# Altium project UKU201.PrjPCB
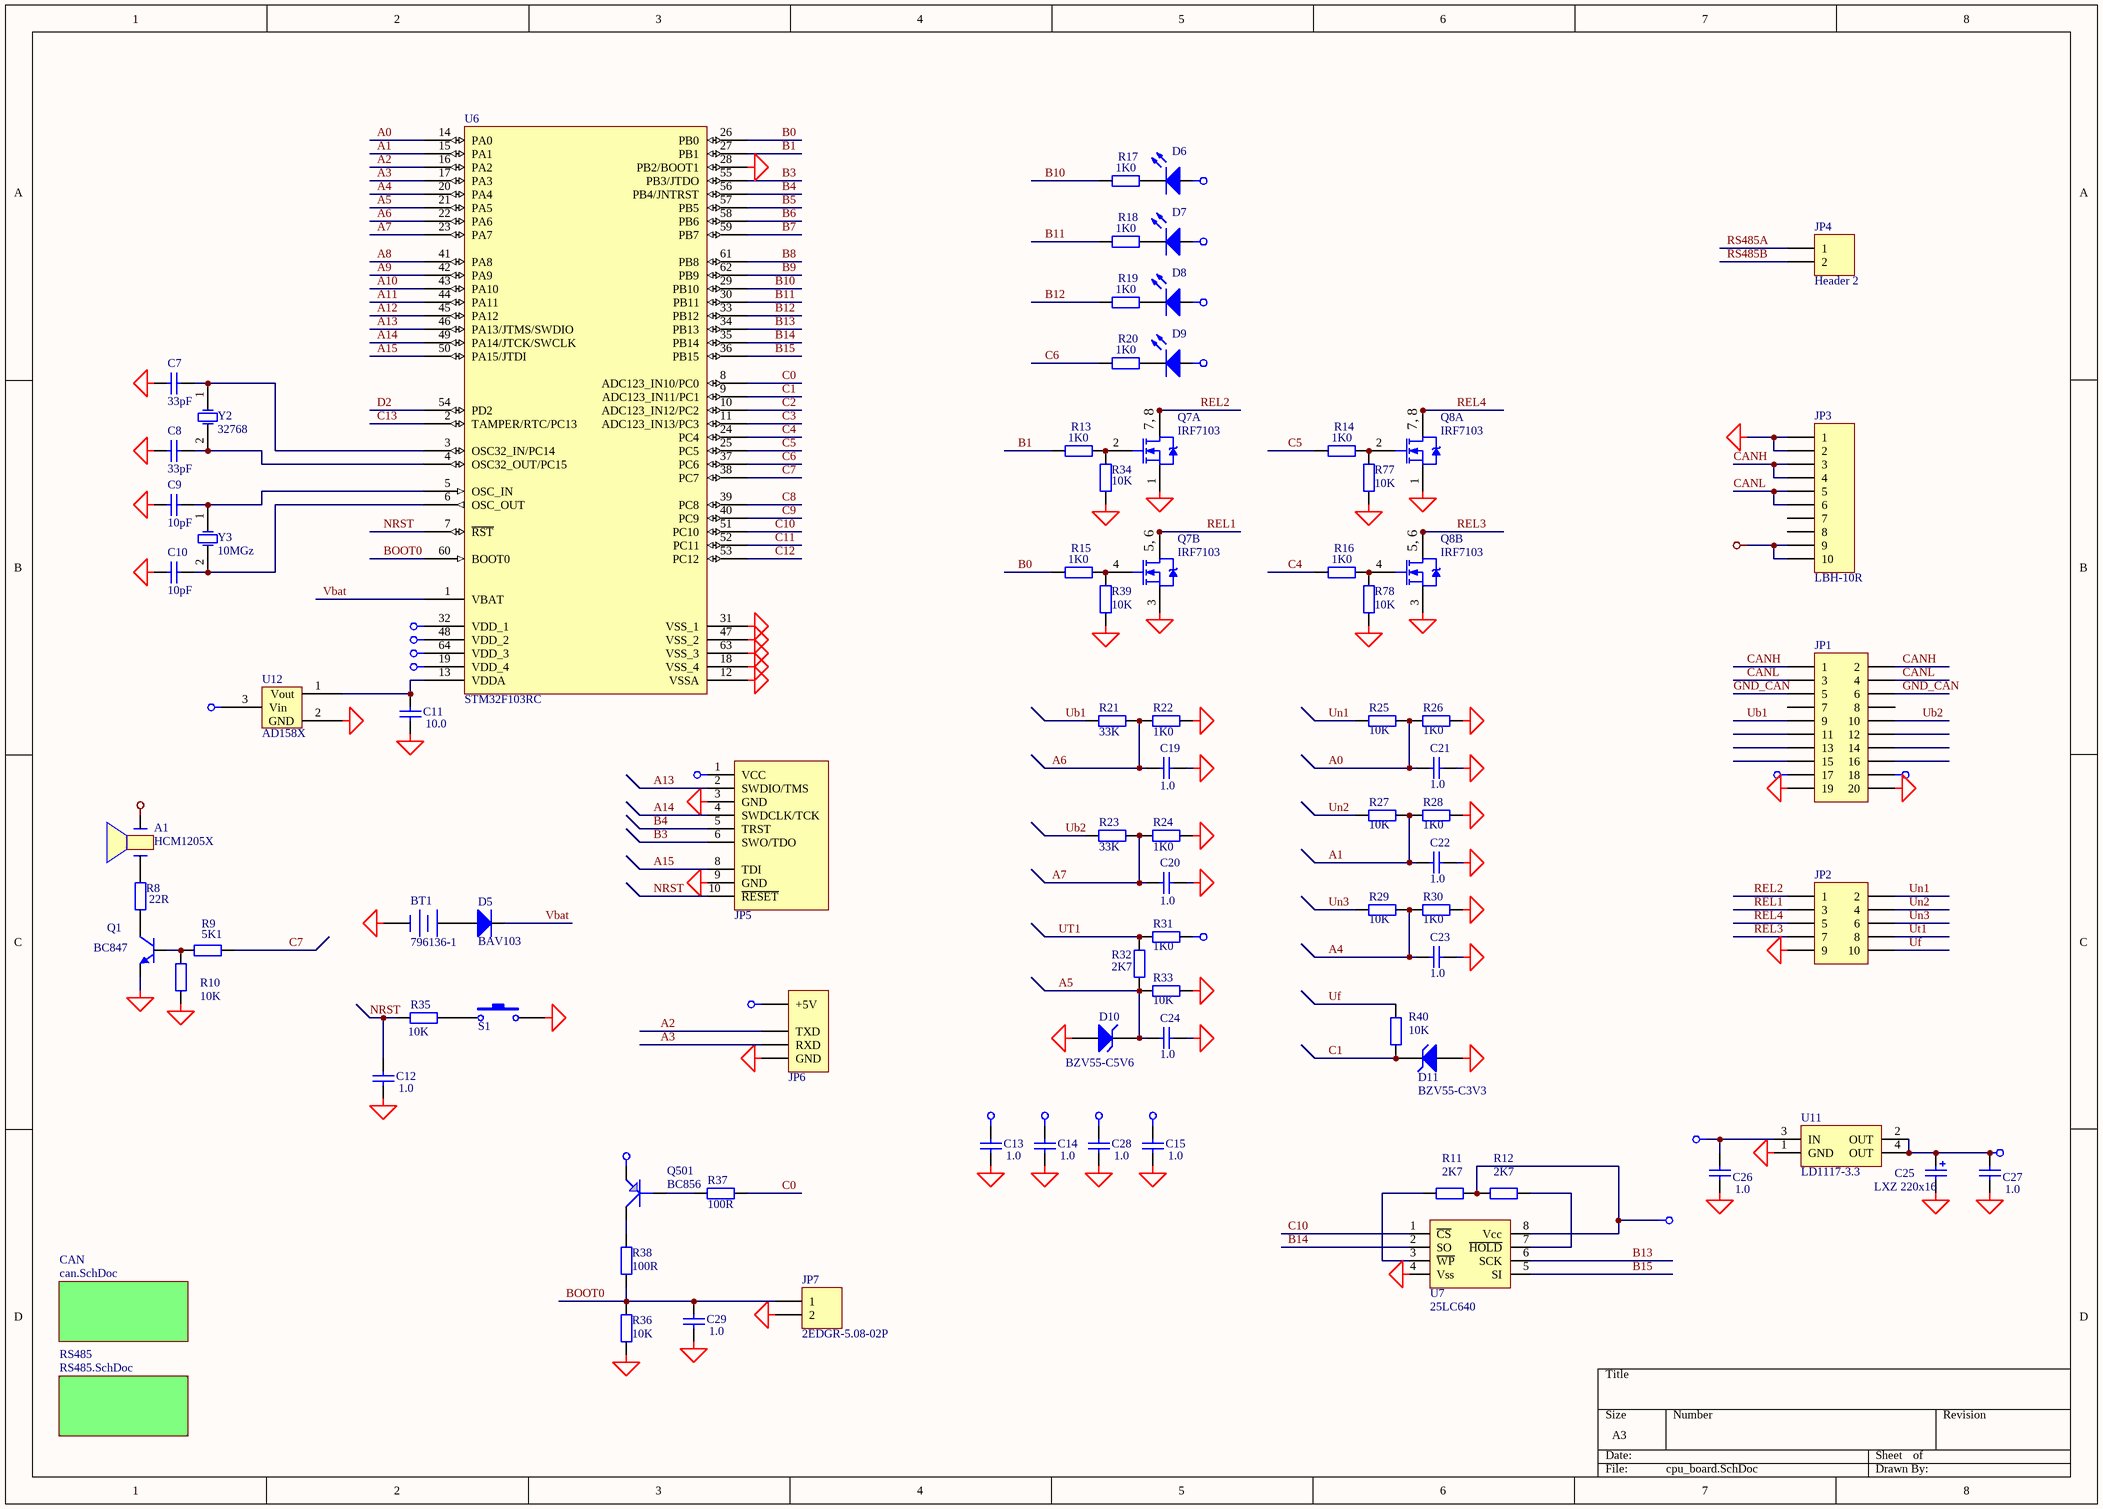
[diagram p0: cpu_board.SchDoc]
2 sheets, 102 parts. Net scope: global (net labels, ports and power ports of the same name join across sheets).
Board file: uku201.PcbDoc
Sheets:
  cpu_board.SchDoc
    CAN = can.SchDoc

## Sheet cpu_board.SchDoc
size A3

### Parts
A1  HCM1205X  [zumm]
BT1  796136-1  [BAT_HOLD_SMD]
C7  33pF  [_1206]
C8  33pF  [_1206]
C9  10pF  [_1206]
C10  10pF  [_1206]
C11  10.0  [_1206]
C12  1.0  [_1206]
C13  1.0  [_1206]
C14  1.0  [_1206]
C15  1.0  [_1206]
C19  1.0  [_1206]
C20  1.0  [_1206]
C21  1.0  [_1206]
C22  1.0  [_1206]
C23  1.0  [_1206]
C24  1.0  [_1206]
C25  LXZ 220x16  [el3]
C26  1.0  [_1206]
C27  1.0  [_1206]
C28  1.0  [_1206]
C29  1.0  [_1206]
D5  BAV103  [_1206d]
D6  LED0  [el3]  (value not drawn)
D7  LED0  [el3]  (value not drawn)
D8  LED0  [el3]  (value not drawn)
D9  LED0  [el3]  (value not drawn)
D10  BZV55-C5V6  [_1206d]
D11  BZV55-C3V3  [_1206d]
JP1  PBD-10  [HDR2X10]  (value not drawn)
JP2  PBD-10  [HDR2X5]  (value not drawn)
JP3  LBH-10R  [SCM-10MR]
JP4  Header 2  [2EDGR-5.0-2P]
JP5  CORTEX_DEBUG_CONNECTOR_PAL  [CORTEX_DEBUG_CONNECTOR]  (value not drawn)
JP6  UART_PORT  [HDR1X5_uart]  (value not drawn)
JP7  2EDGR-5.08-02P  [HDR1X2]
Q1  BC847  [SO-G3]
Q7  IRF7103  [SO-G8/Y2.2]  (parts A,B of 2)
Q8  IRF7103  [SO-G8/Y2.2]  (parts A,B of 2)
Q501  BC856  [SO-G3]
R8  22R  [_1206]
R9  5K1  [_1206]
R10  10K  [_1206]
R11  2K7  [_1206]
R12  2K7  [_1206]
R13  1K0  [_1206]
R14  1K0  [_1206]
R15  1K0  [_1206]
R16  1K0  [_1206]
R17  1K0  [_1206]
R18  1K0  [_1206]
R19  1K0  [_1206]
R20  1K0  [_1206]
R21  33K  [_1206]
R22  1K0  [_1206]
R23  33K  [_1206]
R24  1K0  [_1206]
R25  10K  [_1206]
R26  1K0  [_1206]
R27  10K  [_1206]
R28  1K0  [_1206]
R29  10K  [_1206]
R30  1K0  [_1206]
R31  1K0  [_1206]
R32  2K7  [_1206]
R33  10K  [_1206]
R34  10K  [_1206]
R35  10K  [_1206]
R36  10K  [_1206]
R37  100R  [_1206]
R38  100R  [_1206]
R39  10K  [_1206]
R40  10K  [_1206]
R77  10K  [_1206]
R78  10K  [_1206]
S1  SWT-3  [SWT-6R]  (value not drawn)
U6  STM32F103RC  [F-QFP10X10-G64/N]
U7  25LC640  [SO-G8/D5]
U11  LD1117-3.3  [DSO-G3]
U12  AD158X  [so-g3]
Y2  32768  [QWARZ2]
Y3  10MGz  [QWARZ1]

### Sub-sheets
CAN = can.SchDoc: no entries
RS485 = RS485.SchDoc (file not in this document): no entries

### Nets
+3v3: C13.2 C14.2 C25.1 C27.2 C28.2 D6.1(A) D7.1(A) D8.1(A) D9.1(A) JP5.1(VCC) Q501.2(E) U6.19(VDD_4) U6.32(VDD_1) U6.48(VDD_2) U6.64(VDD_3) U11.2(OUT) U11.4(OUT)
+5v: A1.1 C15.2 C26.2 JP1.17 JP1.18 JP3.9 JP3.10 JP6.1(+5V) R11.2 R12.1 R31.2 U7.8(Vcc) U11.3(IN) U12.3(Vin)
GND: BT1.2(-) C7.1 C8.1 C9.1 C10.1 C11.1 C12.1 C13.1 C14.1 C15.1 C19.2 C20.2 C21.2 C22.2 C23.2 C24.2 C25.2 C26.1 C27.1 C28.1 C29.1 D10.1(A) D11.1(A) JP1.19 JP1.20 JP2.9 JP3.1 JP3.2 JP5.3(GND) JP5.9(GND) JP7.2 Q1.2(E) Q7.1(S) Q7.3(S) Q8.1(S) Q8.3(S) R10.2 R22.2 R24.2 R26.2 R28.2 R30.2 R33.1 R34.1 R36.1 R39.1 R77.1 R78.1 S1.1 U6.12(VSSA) U6.18(VSS_4) U6.28(PB2/BOOT1) U6.31(VSS_1) U6.47(VSS_2) U6.63(VSS_3) U7.4(Vss) U11.1(GND) U12.2(GND)
GND_CAN: JP1.5 JP1.6
SGND: JP6.5(GND)
A0: C21.1 R25.1 R26.1 U6.14(PA0)
A1: C22.1 R27.1 R28.1 U6.15(PA1)
A2: JP6.3(TXD) U6.16(PA2)
A3: JP6.4(RXD) U6.17(PA3)
A4: C23.1 R29.1 R30.1 U6.20(PA4)
A5: C24.1 D10.2(K) R32.2 R33.2 U6.21(PA5)
A6: C19.1 R21.1 R22.1 U6.22(PA6)
A7: C20.1 R23.1 R24.1 U6.23(PA7)
A8: U6.41(PA8)
A9: U6.42(PA9)
A10: U6.43(PA10)
A11: U6.44(PA11)
A12: U6.45(PA12)
A13: JP5.2(SWDIO/TMS) U6.46(PA13/JTMS/SWDIO)
A14: JP5.4(SWDCLK/TCK) U6.49(PA14/JTCK/SWCLK)
A15: JP5.8(TDI) U6.50(PA15/JTDI)
B0: R15.1 U6.26(PB0)
B1: R13.1 U6.27(PB1)
B3: JP5.6(SWO/TDO) U6.55(PB3/JTDO)
B4: JP5.5(TRST) U6.56(PB4/JNTRST)
B5: U6.57(PB5)
B6: U6.58(PB6)
B7: U6.59(PB7)
B8: U6.61(PB8)
B9: U6.62(PB9)
B10: R17.1 U6.29(PB10)
B11: R18.1 U6.30(PB11)
B12: R19.1 U6.33(PB12)
B13: U6.34(PB13) U7.6(SCK)
B14: U6.35(PB14) U7.2(SO)
B15: U6.36(PB15) U7.5(SI)
BOOT0: C29.2 JP7.1 R36.2 R38.1 U6.60(BOOT0)
C0: R37.1 U6.8(ADC123_IN10/PC0)
C1: D11.2(K) R40.2 U6.9(ADC123_IN11/PC1)
C2: U6.10(ADC123_IN12/PC2)
C3: U6.11(ADC123_IN13/PC3)
C4: R16.1 U6.24(PC4)
C5: R14.1 U6.25(PC5)
C6: R20.1 U6.37(PC6)
C7: R9.2 U6.38(PC7)
C8: U6.39(PC8)
C9: U6.40(PC9)
C10: U6.51(PC10) U7.1(~{CS})
C11: U6.52(PC11)
C12: U6.53(PC12)
C13: U6.2(TAMPER/RTC/PC13)
CANH: JP1.1 JP1.2 JP3.3 JP3.4
CANL: JP1.3 JP1.4 JP3.5 JP3.6
D2: U6.54(PD2)
NRST: C12.2 JP5.10(~{RESET}) R35.1 U6.7(~{RST})
REL1: JP2.3 Q7.5(D) Q7.6(D)
REL2: JP2.1 Q7.7(D) Q7.8(D)
REL3: JP2.7 Q8.5(D) Q8.6(D)
REL4: JP2.5 Q8.7(D) Q8.8(D)
RS485A: JP4.1
RS485B: JP4.2
Ub1: JP1.9 R21.2
Ub2: JP1.10 R23.2
Uf: JP2.10 R40.1
Un1: JP2.2 R25.2
Un2: JP2.4 R27.2
Un3: JP2.6 R29.2
Ut1: JP2.8 R31.1 R32.1
Vbat: D5.2(K) U6.1(VBAT)
NetA1_2: A1.2 R8.1
NetBT1_1: BT1.1(+) D5.1(A)
NetC7_2: C7.2 U6.3(OSC32_IN/PC14) Y2.1(OSC1)
NetC8_2: C8.2 U6.4(OSC32_OUT/PC15) Y2.2(OSC2)
NetC9_2: C9.2 U6.5(OSC_IN) Y3.1(OSC1)
NetC10_2: C10.2 U6.6(OSC_OUT) Y3.2(OSC2)
NetC11_2: C11.2 U6.13(VDDA) U12.1(Vout)
NetD6_2: D6.2(K) R17.2
NetD7_2: D7.2(K) R18.2
NetD8_2: D8.2(K) R19.2
NetD9_2: D9.2(K) R20.2
NetQ1_1: Q1.1(B) R9.1 R10.1
NetQ1_3: Q1.3(C) R8.2
NetQ7_2: Q7.2(G) R13.2 R34.2
NetQ7_4: Q7.4(G) R15.2 R39.2
NetQ8_2: Q8.2(G) R14.2 R77.2
NetQ8_4: Q8.4(G) R16.2 R78.2
NetQ501_1: Q501.1(B) R37.2
NetQ501_3: Q501.3(C) R38.2
NetR11_1: R11.1 U7.3(~{WP})
NetR12_2: R12.2 U7.7(~{HOLD})
NetR35_2: R35.2 S1.2

Not connected (* = marked no-connect by the designer): JP1 7 8 11 12 13 14 15 16; JP3 7 8

### Notes on the sheet
- (in symbol IRF7301, part A) 7, 8
- (in symbol IRF7301, part B) 5, 6

### Library data of the parts
A1 = PJEZ0: Beeper; Value: EFM260
BT1 = Battery: Multicell Battery; Manufacturer: Generic Components; Published: 24-Mar-1999; Revision: July-2002: Re-released for DXP Platform.; Publisher: Altium Limited
C7 C8 = Cap Semi: Capacitor (Semiconductor SIM Model); Manufacturer: Generic Components; Class I: Passive; Value: 15pF; Published: 8-Jun-2000; Revision: July-2002: Re-released for DXP Platform.; Publisher: Altium Limited; Class II: Capacitor
C9 C10 = Cap Semi: Capacitor; Manufacturer: Generic Components; Class I: Passive; Value: 15pF; Published: 8-Jun-2000; Revision: July-2002: Re-released for DXP Platform.; Publisher: Altium Limited; Class II: Capacitor
C11-C15 C26-C29 = Cap Semi: Capacitor; Manufacturer: Generic Components; Class I: Passive; Value: 0,1; Published: 8-Jun-2000; Revision: July-2002: Re-released for DXP Platform.; Publisher: Altium Limited; Class II: Capacitor
C19-C24 = Cap Semi: Capacitor; Manufacturer: Generic Components; Class I: Passive; Value: 1,0; Published: 8-Jun-2000; Revision: July-2002: Re-released for DXP Platform.; Publisher: Altium Limited; Class II: Capacitor
C25 = Cap Pol1: Polarized Capacitor (Radial); Manufacturer: Generic Components; Class I: Passive; Value: 22,0x50; Published: 8-Jun-2000; Revision: July-2002: Re-released for DXP Platform.; Publisher: Altium Limited; Class II: Capacitor
D5 = Diode: Default Diode; Manufacturer: Generic Components; Class I: Discrete; Class II: Diode - Switching; Published: 8-Jun-2000; Revision: July-2002: Re-released for DXP Platform.; Publisher: Altium Limited
D6-D9 = LED0: Typical INFRARED GaAs LED; Manufacturer: Generic Components; Class I: Optoelectronic; Published: 8-Jun-2000; Revision: July-2002: Re-released for DXP Platform.; Publisher: Altium Limited; Class II: LED
D10 D11 = D Zener: Zener Diode; Manufacturer: Generic Components; Class I: Discrete; Class II: Diode - Zener; Value: BZV55C5V6; Published: 8-Jun-2000; Revision: July-2002: Re-released for DXP Platform.; Publisher: Altium Limited
JP1 = Header 10X2: Header, 10-Pin, Dual row; Manufacturer: Generic Components; Class I: Connector; Revision: July-2002: Re-released for DXP Platform.; Publisher: Altium Limited
JP2 = Header 5X2: Header, 5-Pin, Dual row; Manufacturer: Generic Components; Class I: Connector; Revision: July-2002: Re-released for DXP Platform.; Publisher: Altium Limited
JP3 = Header 10: Header, 10-Pin; Manufacturer: Generic Components; Class I: Connector; Revision: July-2002: Re-released for DXP Platform.; Publisher: Altium Limited
JP4 JP7 = Header 2: Header, 2-Pin; Manufacturer: Generic Components; Class I: Connector; Revision: July-2002: Re-released for DXP Platform.; Publisher: Altium Limited
JP6 = UART_PORT: Header, 5-Pin; Manufacturer: Generic Components; Class I: Connector; Revision: July-2002: Re-released for DXP Platform.; Publisher: Altium Limited
Q1 = BC847ALT1: General Purpose Transistor NPN Silicon; Manufacturer: Motorola; Package Information: Latest Revision: 1997; Class I: Discrete; Class II: BJT - Low Power; Published: 29-Sep-2000; Revision: July-2002: Re-released for DXP Platform.; Datasheet: Latest Revision: 1997; Package Reference: 318-08; Publisher: Altium Limited
Q7 Q8 = IRF7301: FET; Manufacturer: International Rectifier; Revision 1: 29-Sep-2000: Re-orientated a 'Drain' pin on first part.; Revision 2: July-2002: Re-released for DXP Platform.; Class I: Discrete; Class II: MOSFET - Power; Published: 8-Jun-2000; Datasheet: Latest Revision: Aug-1997; Package Reference: SOIC8; Publisher: Altium Limited; Value: IRF7103
Q501 = GT109: Bipolar transistor; Right: 20; Bottom: 20; Value: BC856
R8 = Res2: Resistor; Manufacturer: Generic Components; Class I: Passive; Value: 10R; Published: 8-Jun-2000; Revision: July-2002: Re-released for DXP Platform.; Publisher: Altium Limited; Class II: Resistor
R9 = Res2: Resistor; Manufacturer: Generic Components; Class I: Passive; Value: 1K; Published: 8-Jun-2000; Revision: July-2002: Re-released for DXP Platform.; Publisher: Altium Limited; Class II: Resistor
R10 = Res2: Resistor; Manufacturer: Generic Components; Class I: Passive; Published: 8-Jun-2000; Revision: July-2002: Re-released for DXP Platform.; Publisher: Altium Limited; Class II: Resistor; Value: 10K
R11-R34 R39 R40 R77 R78 = Res2: Resistor; Manufacturer: Generic Components; Class I: Passive; Rule: Undefined; Published: 8-Jun-2000; Revision: July-2002: Re-released for DXP Platform.; Publisher: Altium Limited; Class II: Resistor
  R11 R12 R32: Value: 2K7
  R13-R20 R22 R24 R26 R28 R30 R31: Value: 1K0
  R21 R23: Value: 33K
  R25 R27 R29 R33 R34 R39 R40 R77 R78: Value: 10K
R35-R38 = RES: Resistor; Manufacturer: Generic Components; Class I: Passive; Value: 1K; Published: 8-Jun-2000; Revision: July-2002: Re-released for DXP Platform.; Publisher: Altium Limited; Class II: Resistor
S1 = SWT-6: Switch; Manufacturer: Generic Components; Published: 24-Mar-1999; Revision: July-2002: Re-released for DXP Platform.; Publisher: Altium Limited
U6 = STM32F103RC: STM32 ARM-based 32-bit MCU with 64 Kbytes Flash, 64-pin LQFP, Industrial Temperature; Published: *; DatasheetVersion: *; PackageVersion: *; PackageReference: *; Publisher: *; PackageDescription: *; ComponentLink1Description: *; ComponentLink1URL: *; ComponentLink2Description: *; ComponentLink2URL: *
U7 = 25LC640: Memory; Value: 26LC640
U11 = REG1117-3.3: 800mA and 1A Low Dropout Positive Regulator 2.85V, 3.3V, 5V, and Adjustable; Manufacturer: Burr-Brown; Package Information: Latest Revision: Rev. C; Class I: Power Management; Class II: Voltage Regulator; Published: 8-Jun-2000; Revision: July-2002: Re-released for DXP Platform.; Datasheet: Latest Revision: Sep-1997; Package Reference: ZZ311; Publisher: Altium Limited
Y2 Y3 = XTAL: Crystal Oscillator; Manufacturer: Generic Components; Published: 8-Jun-2000; Revision: July-2002: Re-released for DXP Platform.; Publisher: Altium Limited; Class I: Oscillator; Class II: Crystal Oscillator
  Y3: Value: 10MGz

## Sheet can.SchDoc
size A4
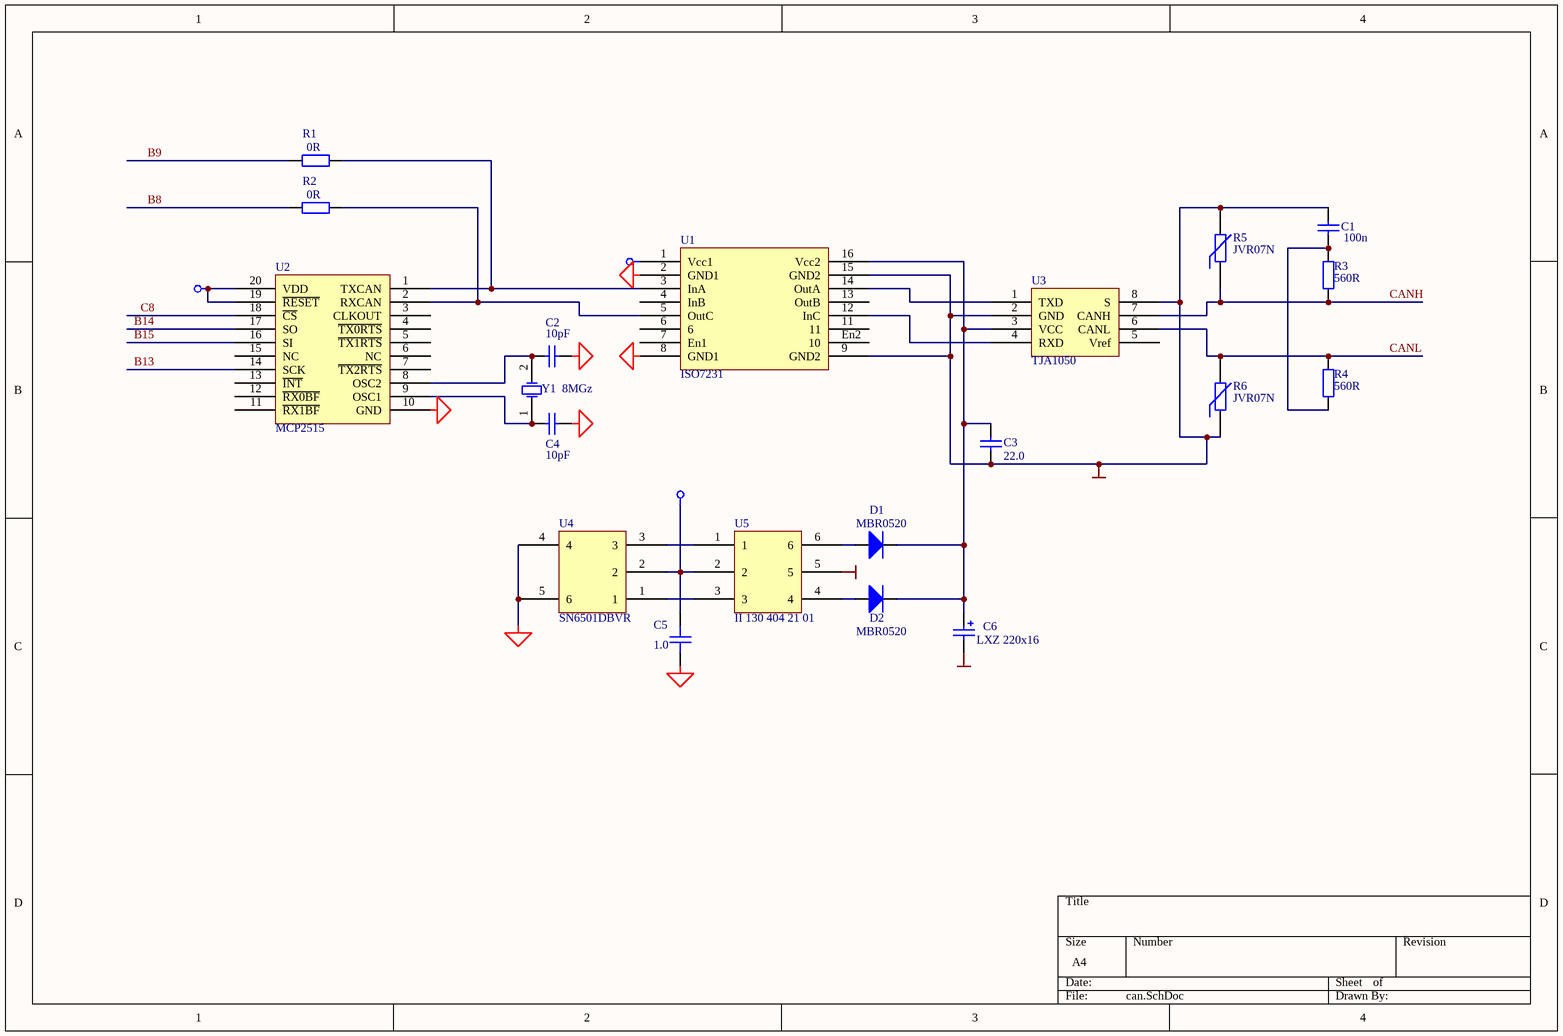
[diagram p1: can.SchDoc]

### Parts
C1  100n  [_1206]
C2  10pF  [_1206]
C3  22.0  [_1206]
C4  10pF  [_1206]
C5  1.0  [_1206]
C6  LXZ 220x16  [el3]
D1  MBR0520  [_1206d]
D2  MBR0520  [_1206d]
R1  0R  [_1206]
R2  0R  [_1206]
R3  560R  [_1206]
R4  560R  [_1206]
R5  JVR07N  [JVR07N]
R6  JVR07N  [JVR07N]
U1  ISO7231  [SO-G16/D10.4]
U2  MCP2515  [TSSO6X6-G20/D6.6]
U3  TJA1050  [SO-G8/D5]
U4  SN6501DBVR  [SO-G5/P.95]
U5  II 130 404 21 01  [II1304042101]
Y1  8MGz  [QWARZ1]

### Nets
+3v3: U2.19(~{RESET}) U2.20(VDD)
+5v: C5.2 U1.1(Vcc1) U4.2 U5.2
GND: C2.1 C4.1 C5.1 U1.2(GND1) U1.8(GND1) U2.10(GND) U4.4 U4.5(6)
GND_CAN: C1.2 C3.2 C6.2 R5.2 R6.1 U1.9(GND2) U1.15(GND2) U3.2(GND) U3.8(S) U5.5
B8: R2.1
B9: R1.1
B13: U2.14(SCK)
B14: U2.17(SO)
B15: U2.16(SI)
C8: U2.18(~{CS})
CANH: R3.1 R5.1 U3.7(CANH)
CANL: R4.2 R6.2 U3.6(CANL)
NetC1_1: C1.1 R3.2 R4.1
NetC2_2: C2.2 U2.8(OSC2) Y1.2(OSC2)
NetC3_1: C3.1 C6.1 D1.2(K) D2.2(K) U1.16(Vcc2) U3.3(VCC)
NetC4_2: C4.2 U2.9(OSC1) Y1.1(OSC1)
NetD1_1: D1.1(A) U5.6
NetD2_1: D2.1(A) U5.4
NetR1_2: R1.2 U1.3(InA) U2.1(TXCAN)
NetR2_2: R2.2 U1.5(OutC) U2.2(RXCAN)
NetU1_12: U1.12(InC) U3.4(RXD)
NetU1_14: U1.14(OutA) U3.1(TXD)
NetU4_1: U4.1 U5.3
NetU4_3: U4.3 U5.1

Not connected (* = marked no-connect by the designer): U1 4(InB) 6 7(En1) 11 13(OutB) En2(10); U2 3(CLKOUT) 4(~{TX0RTS}) 5(~{TX1RTS}) 6(NC) 7(~{TX2RTS}) 11(~{RX1BF}) 12(~{RX0BF}) 13(~{INT}) 15(NC); U3 5(Vref); U4 6(5)

### Library data of the parts
C1 C3 = Cap Semi: Capacitor (Semiconductor SIM Model); Manufacturer: Generic Components; Class I: Passive; Value: 1,0; Published: 8-Jun-2000; Revision: July-2002: Re-released for DXP Platform.; Publisher: Altium Limited; Class II: Capacitor
C2 C4 = Cap Semi: Capacitor (Semiconductor SIM Model); Manufacturer: Generic Components; Class I: Passive; Published: 8-Jun-2000; Revision: July-2002: Re-released for DXP Platform.; Publisher: Altium Limited; Class II: Capacitor; Value: 10pF
C5 = C_SM_1206: value: 1u
C6 = Cap Pol1: as C25 on sheet cpu_board; Published: 8-Jun-2000; Revision: July-2002: Re-released for DXP Platform.; Publisher: Altium Limited; Class II: Capacitor
D1 D2 = Diode: as D5 on sheet cpu_board; Published: 8-Jun-2000; Revision: July-2002: Re-released for DXP Platform.; Publisher: Altium Limited
R1 R2 = Res2: Resistor; Manufacturer: Generic Components; Class I: Passive; Value: 2K7; Rule: Undefined; Published: 8-Jun-2000; Revision: July-2002: Re-released for DXP Platform.; Publisher: Altium Limited; Class II: Resistor
R3 R4 = Res2: Resistor; Manufacturer: Generic Components; Class I: Passive; Value: 120; Published: 8-Jun-2000; Revision: July-2002: Re-released for DXP Platform.; Publisher: Altium Limited; Class II: Resistor
R5 R6 = Res Varistor: Varistor (Voltage-Sensitive Resistor); Manufacturer: Generic Components; Class I: Discrete; Published: 24-Mar-1999; Revision: July-2002: Re-released for DXP Platform.; Publisher: Altium Limited; Class II: Voltage-Sensitive Resistor
U4 U5 = PIN6
Y1 = XTAL: as Y2 on sheet cpu_board; Published: 8-Jun-2000; Revision: July-2002: Re-released for DXP Platform.; Publisher: Altium Limited; Class I: Oscillator; Class II: Crystal Oscillator

## Nets that join several sheets
+3v3: cpu_board (17 pins), can (U2.19 U2.20)
+5v: cpu_board (14 pins), can (C5.2 U1.1 U4.2 U5.2)
GND: cpu_board (58 pins), can (8 pins)
GND_CAN: cpu_board (JP1.5 JP1.6), can (10 pins)
B8: cpu_board (U6.61), can (R2.1)
B9: cpu_board (U6.62), can (R1.1)
B13: cpu_board (U6.34 U7.6), can (U2.14)
B14: cpu_board (U6.35 U7.2), can (U2.17)
B15: cpu_board (U6.36 U7.5), can (U2.16)
C8: cpu_board (U6.39), can (U2.18)
CANH: cpu_board (JP1.1 JP1.2 JP3.3 JP3.4), can (R3.1 R5.1 U3.7)
CANL: cpu_board (JP1.3 JP1.4 JP3.5 JP3.6), can (R4.2 R6.2 U3.6)